# Altium project senior_design.PrjPCB
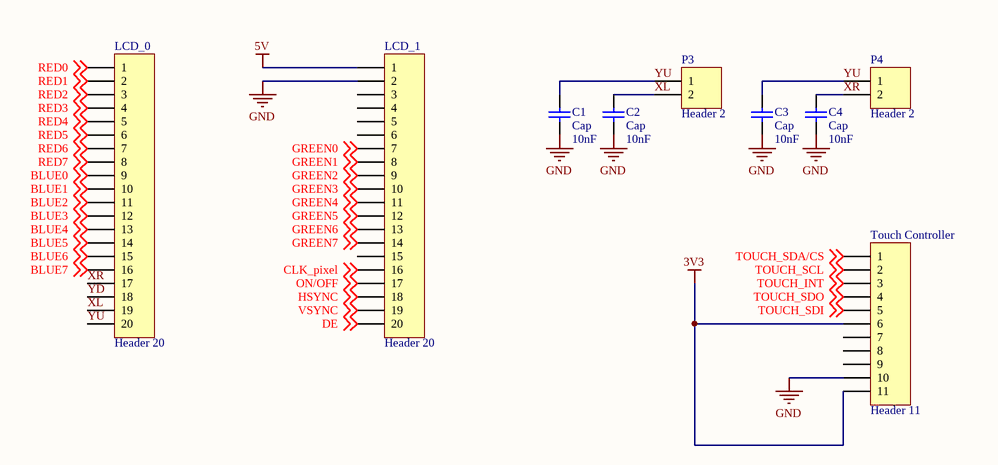
[diagram p0: lcd_breakout.SchDoc]
3 sheets, 19 parts. Net scope: global (net labels, ports and power ports of the same name join across sheets).
Board file: main_pcb_v0.PcbDoc
Sheets:
  lcd_breakout.SchDoc
  fpga_sram.SchDoc
  dac_audio_out.SchDoc

## Sheet lcd_breakout.SchDoc
size A

### Parts
C1  Cap  value 10nF  [6-0805_M]
C2  Cap  value 10nF  [6-0805_M]
C3  Cap  value 10nF  [6-0805_M]
C4  Cap  value 10nF  [6-0805_M]
LCD_0  Header 20  [HDR1X20]
LCD_1  Header 20  [HDR1X20]
P3  Header 2  [HDR1X2]
P4  Header 2  [HDR1X2]
Touch_Controller  Header 11  [HDR1X11]

### Nets
3V3: Touch_Controller.6 Touch_Controller.11
5V: LCD_1.1
GND: C1.1 C2.1 C3.1 C4.1 LCD_1.2 Touch_Controller.10
BLUE0: LCD_0.9 ; off-sheet BLUE0
BLUE1: LCD_0.10 ; off-sheet BLUE1
BLUE2: LCD_0.11 ; off-sheet BLUE2
BLUE3: LCD_0.12 ; off-sheet BLUE3
BLUE4: LCD_0.13 ; off-sheet BLUE4
BLUE5: LCD_0.14 ; off-sheet BLUE5
BLUE6: LCD_0.15 ; off-sheet BLUE6
BLUE7: LCD_0.16 ; off-sheet BLUE7
CLK_pixel: LCD_1.16 ; off-sheet CLK_pixel
DE: LCD_1.20 ; off-sheet DE
GREEN0: LCD_1.7 ; off-sheet GREEN0
GREEN1: LCD_1.8 ; off-sheet GREEN1
GREEN2: LCD_1.9 ; off-sheet GREEN2
GREEN3: LCD_1.10 ; off-sheet GREEN3
GREEN4: LCD_1.11 ; off-sheet GREEN4
GREEN5: LCD_1.12 ; off-sheet GREEN5
GREEN6: LCD_1.13 ; off-sheet GREEN6
GREEN7: LCD_1.14 ; off-sheet GREEN7
HSYNC: LCD_1.18 ; off-sheet HSYNC
ON/OFF: LCD_1.17 ; off-sheet ON/OFF
RED0: LCD_0.1 ; off-sheet RED0
RED1: LCD_0.2 ; off-sheet RED1
RED2: LCD_0.3 ; off-sheet RED2
RED3: LCD_0.4 ; off-sheet RED3
RED4: LCD_0.5 ; off-sheet RED4
RED5: LCD_0.6 ; off-sheet RED5
RED6: LCD_0.7 ; off-sheet RED6
RED7: LCD_0.8 ; off-sheet RED7
TOUCH_INT: Touch_Controller.3 ; off-sheet TOUCH_INT
TOUCH_SCL: Touch_Controller.2 ; off-sheet TOUCH_SCL
TOUCH_SDA/CS: Touch_Controller.1 ; off-sheet TOUCH_SDA/CS
TOUCH_SDI: Touch_Controller.5 ; off-sheet TOUCH_SDI
TOUCH_SDO: Touch_Controller.4 ; off-sheet TOUCH_SDO
VSYNC: LCD_1.19 ; off-sheet VSYNC
XL: C2.2 LCD_0.19 P3.2
XR: C4.2 LCD_0.17 P4.2
YD: LCD_0.18
YU: C1.2 C3.2 LCD_0.20 P3.1 P4.1

Not connected (* = marked no-connect by the designer): LCD_1 3 4 5 6 15; Touch_Controller 7 8 9

### Library data of the parts
C1-C4 = Cap: Capacitor; Published: 8-Jun-2000; LatestRevisionDate: 17-Jul-2002; LatestRevisionNote: Re-released for DXP Platform.; PackageReference: RAD-0.3; Publisher: Altium Limited; PackageDescription: Radial Cap, Thru-Hole; 2 Leads; 0.3 in Pin Spacing
LCD_0 LCD_1 = Header 20: Header, 20-Pin; LatestRevisionDate: 17-Jul-2002; LatestRevisionNote: Re-released for DXP Platform.; Publisher: Altium Limited
P3 P4 = Header 2: Header, 2-Pin; LatestRevisionDate: 17-Jul-2002; LatestRevisionNote: Re-released for DXP Platform.; Publisher: Altium Limited
Touch_Controller = Header 11: Header, 11-Pin; LatestRevisionDate: 17-Jul-2002; LatestRevisionNote: Re-released for DXP Platform.; Publisher: Altium Limited

## Sheet fpga_sram.SchDoc
size A
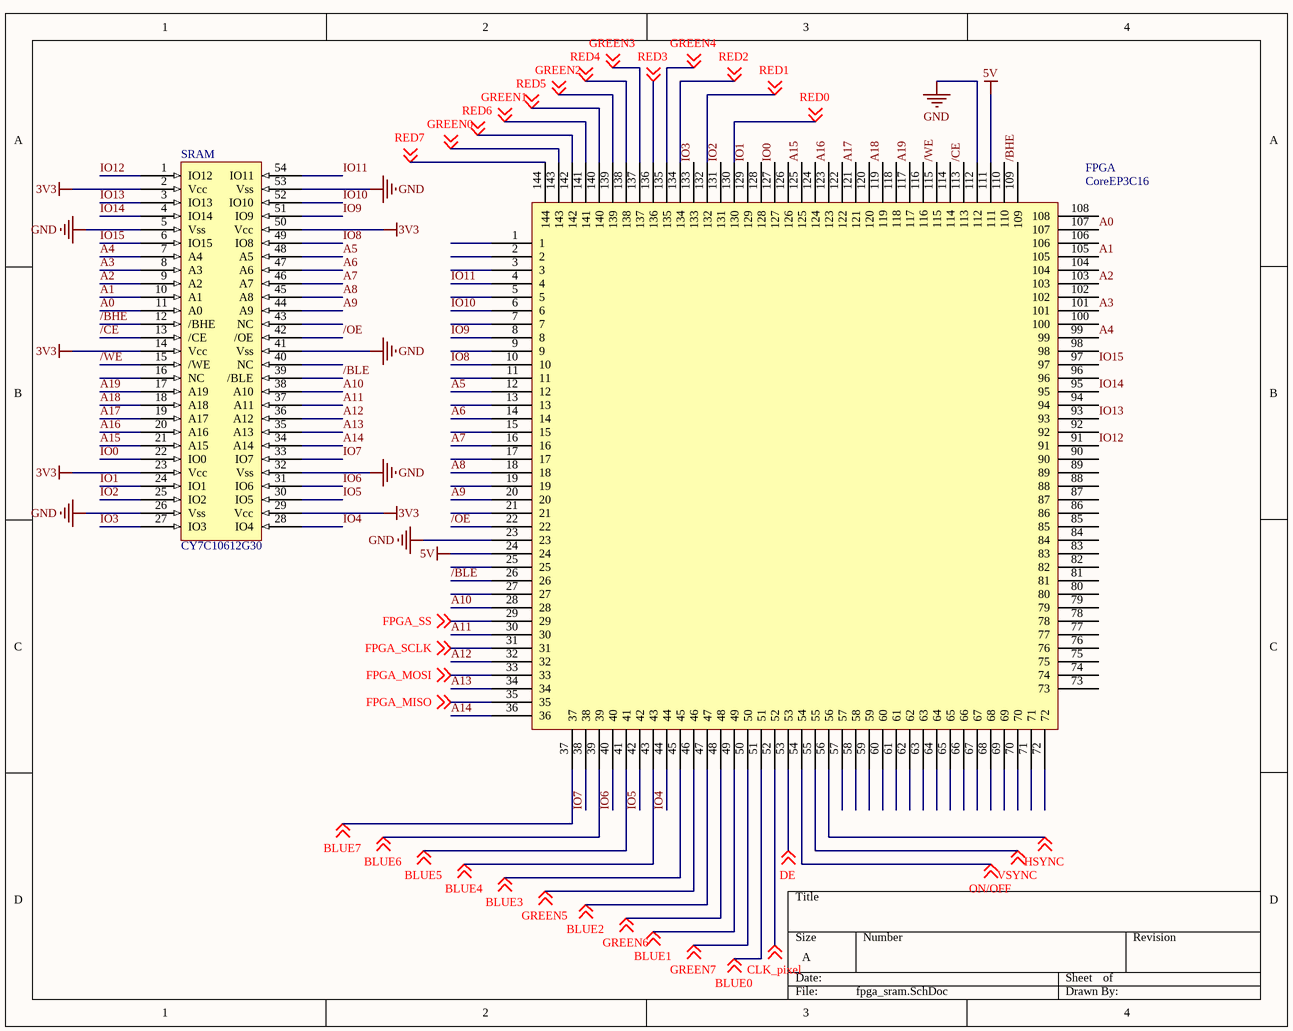
[diagram p1: fpga_sram.SchDoc]

### Parts
FPGA  CoreEP3C16  [CoreEP3C16]
SRAM  CY7C10612G30  [TSOP54]

### Nets
3V3: SRAM.2(Vcc) SRAM.14(Vcc) SRAM.23(Vcc) SRAM.29(Vcc) SRAM.50(Vcc)
5V: FPGA.24 FPGA.111
GND: FPGA.23 FPGA.112 SRAM.5(Vss) SRAM.26(Vss) SRAM.32(Vss) SRAM.41(Vss) SRAM.53(Vss)
/BHE: FPGA.109 SRAM.12(/BHE)
/BLE: FPGA.26 SRAM.39(/BLE)
/CE: FPGA.113 SRAM.13(/CE)
/OE: FPGA.22 SRAM.42(/OE)
/WE: FPGA.115 SRAM.15(/WE)
A0: FPGA.107 SRAM.11(A0)
A1: FPGA.105 SRAM.10(A1)
A2: FPGA.103 SRAM.9(A2)
A3: FPGA.101 SRAM.8(A3)
A4: FPGA.99 SRAM.7(A4)
A5: FPGA.12 SRAM.48(A5)
A6: FPGA.14 SRAM.47(A6)
A7: FPGA.16 SRAM.46(A7)
A8: FPGA.18 SRAM.45(A8)
A9: FPGA.20 SRAM.44(A9)
A10: FPGA.28 SRAM.38(A10)
A11: FPGA.30 SRAM.37(A11)
A12: FPGA.32 SRAM.36(A12)
A13: FPGA.34 SRAM.35(A13)
A14: FPGA.36 SRAM.34(A14)
A15: FPGA.125 SRAM.21(A15)
A16: FPGA.123 SRAM.20(A16)
A17: FPGA.121 SRAM.19(A17)
A18: FPGA.119 SRAM.18(A18)
A19: FPGA.117 SRAM.17(A19)
BLUE0: FPGA.51 ; off-sheet BLUE0
BLUE1: FPGA.49 ; off-sheet BLUE1
BLUE2: FPGA.47 ; off-sheet BLUE2
BLUE3: FPGA.45 ; off-sheet BLUE3
BLUE4: FPGA.43 ; off-sheet BLUE4
BLUE5: FPGA.41 ; off-sheet BLUE5
BLUE6: FPGA.39 ; off-sheet BLUE6
BLUE7: FPGA.37 ; off-sheet BLUE7
CLK_pixel: FPGA.52 ; off-sheet CLK_pixel
DE: FPGA.53 ; off-sheet DE
FPGA_MISO: FPGA.35 ; off-sheet FPGA_MISO
FPGA_MOSI: FPGA.33 ; off-sheet FPGA_MOSI
FPGA_SCLK: FPGA.31 ; off-sheet FPGA_SCLK
FPGA_SS: FPGA.29 ; off-sheet FPGA_SS
GREEN0: FPGA.143 ; off-sheet GREEN0
GREEN1: FPGA.141 ; off-sheet GREEN1
GREEN2: FPGA.139 ; off-sheet GREEN2
GREEN3: FPGA.137 ; off-sheet GREEN3
GREEN4: FPGA.135 ; off-sheet GREEN4
GREEN5: FPGA.46 ; off-sheet GREEN5
GREEN6: FPGA.48 ; off-sheet GREEN6
GREEN7: FPGA.50 ; off-sheet GREEN7
HSYNC: FPGA.56 ; off-sheet HSYNC
IO0: FPGA.127 SRAM.22(IO0)
IO1: FPGA.129 SRAM.24(IO1)
IO2: FPGA.131 SRAM.25(IO2)
IO3: FPGA.133 SRAM.27(IO3)
IO4: FPGA.44 SRAM.28(IO4)
IO5: FPGA.42 SRAM.30(IO5)
IO6: FPGA.40 SRAM.31(IO6)
IO7: FPGA.38 SRAM.33(IO7)
IO8: FPGA.10 SRAM.49(IO8)
IO9: FPGA.8 SRAM.51(IO9)
IO10: FPGA.6 SRAM.52(IO10)
IO11: FPGA.4 SRAM.54(IO11)
IO12: FPGA.91 SRAM.1(IO12)
IO13: FPGA.93 SRAM.3(IO13)
IO14: FPGA.95 SRAM.4(IO14)
IO15: FPGA.97 SRAM.6(IO15)
ON/OFF: FPGA.54 ; off-sheet ON/OFF
RED0: FPGA.130 ; off-sheet RED0
RED1: FPGA.132 ; off-sheet RED1
RED2: FPGA.134 ; off-sheet RED2
RED3: FPGA.136 ; off-sheet RED3
RED4: FPGA.138 ; off-sheet RED4
RED5: FPGA.140 ; off-sheet RED5
RED6: FPGA.142 ; off-sheet RED6
RED7: FPGA.144 ; off-sheet RED7
VSYNC: FPGA.55 ; off-sheet VSYNC

Not connected (* = marked no-connect by the designer): FPGA 1 2 3 5 7 9 11 13 15 17 19 21 25 27 57 58 59 60 61 62 63 64 65 66 67 68 69 70 71 72 73 74 75 76 77 78 79 80 81 82 83 84 85 86 87 88 89 90 92 94 96 98 100 102 104 106 108 110 114 116 118 120 122 124 126 128; SRAM 16(NC) 40(NC) 43(NC)

## Sheet dac_audio_out.SchDoc
size A
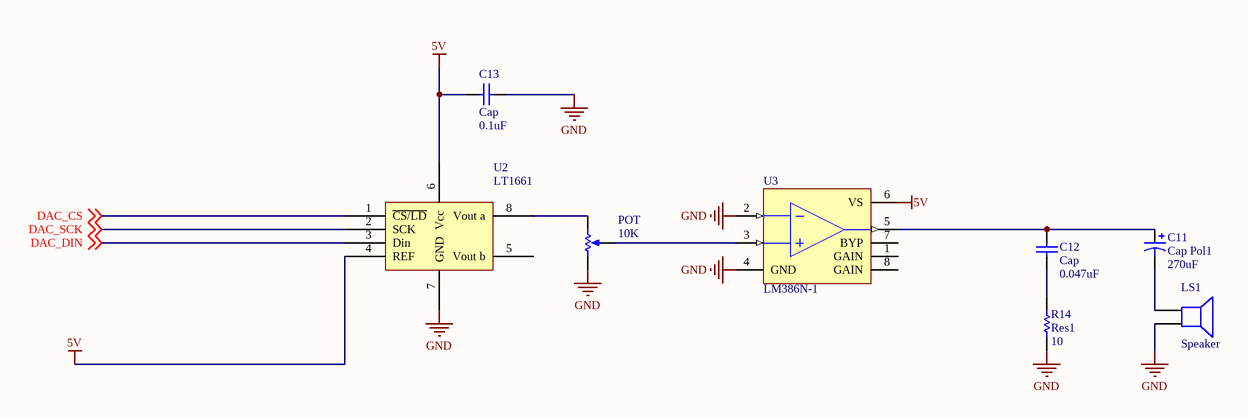
[diagram p2: dac_audio_out.SchDoc]

### Parts
C11  Cap Pol1  value 270uF  [6-0805_M]
C12  Cap  value 0.047uF  [6-0805_M]
C13  Cap  value 0.1uF  [6-0805_M]
LS1  Speaker  [PIN2]
POT  value 10K  [VR5]  (hidden comment: RPot_3)
R14  Res1  value 10  [6-0805_M]
U2  LT1661  [DIP-8]
U3  LM386N-1  [DIP-8]

### Nets
5V: C13.1 U2.4(REF) U2.6(Vcc) U3.6(VS)
GND: C13.2 LS1.2 POT.1(TOP) R14.1 U2.7(GND) U3.2(IN-) U3.4(GND)
DAC_CS: U2.1(~{CS/LD}) ; off-sheet DAC_CS
DAC_DIN: U2.3(Din) ; off-sheet DAC_DIN
DAC_SCK: U2.2(SCK) ; off-sheet DAC_SCK
NetC11_1: C11.1 C12.2 U3.5(OUT)
NetC11_2: C11.2 LS1.1
NetC12_1: C12.1 R14.2
NetPOT_2: POT.2(TAP) U3.3(IN+)
NetPOT_3: POT.3(BOT) U2.8(Vout_a)

Not connected (* = marked no-connect by the designer): U2 5(Vout_b); U3 1(GAIN) 7(BYP) 8(GAIN)

### Library data of the parts
C11 = Cap Pol1: Polarized Capacitor (Radial); Published: 8-Jun-2000; LatestRevisionDate: 17-Jul-2002; LatestRevisionNote: Re-released for DXP Platform.; PackageReference: RB7.6-15; Publisher: Altium Limited; PackageDescription: Polarized Capacitor (Radial); 2 Leads
C12 C13 = Cap: Capacitor; Published: 8-Jun-2000; LatestRevisionDate: 17-Jul-2002; LatestRevisionNote: Re-released for DXP Platform.; PackageReference: RAD-0.3; Publisher: Altium Limited; PackageDescription: Radial Cap, Thru-Hole; 2 Leads; 0.3 in Pin Spacing
LS1 = Speaker: Loudspeaker; Published: 24-Mar-1999; LatestRevisionDate: 17-Jul-2002; LatestRevisionNote: Re-released for DXP Platform.; PackageReference: PIN2; Publisher: Altium Limited
POT = RPot: Potentiometer; Sim Note: Enter the Resistance value and the set point into parameter fields.; Set Position: 0.5; Published: 8-Jun-2000; LatestRevisionDate: 17-Jul-2002; LatestRevisionNote: Re-released for DXP Platform.; Publisher: Altium Limited
R14 = Res1: Resistor; Published: 8-Jun-2000; LatestRevisionDate: 17-Jul-2002; LatestRevisionNote: Re-released for DXP Platform.; PackageReference: AXIAL-0.3; Publisher: Altium Limited; PackageDescription: Axial Device, Thru-Hole; 2 Leads; 0.3 in Pin Spacing
U3 = LM386N-1: Low-Voltage Audio Power Amplifier; Published: 15-Apr-2002; DatasheetDocument: Sep-1997; PackageDocument: Sep-1997; PackageReference: N08E; Publisher: Altium Limited

## Nets that join several sheets
3V3: lcd_breakout (Touch_Controller.6 Touch_Controller.11), fpga_sram (5 pins)
5V: lcd_breakout (LCD_1.1), fpga_sram (FPGA.24 FPGA.111), dac_audio_out (C13.1 U2.4 U2.6 U3.6)
GND: lcd_breakout (6 pins), fpga_sram (7 pins), dac_audio_out (7 pins)
BLUE0: lcd_breakout (LCD_0.9), fpga_sram (FPGA.51)
BLUE1: lcd_breakout (LCD_0.10), fpga_sram (FPGA.49)
BLUE2: lcd_breakout (LCD_0.11), fpga_sram (FPGA.47)
BLUE3: lcd_breakout (LCD_0.12), fpga_sram (FPGA.45)
BLUE4: lcd_breakout (LCD_0.13), fpga_sram (FPGA.43)
BLUE5: lcd_breakout (LCD_0.14), fpga_sram (FPGA.41)
BLUE6: lcd_breakout (LCD_0.15), fpga_sram (FPGA.39)
BLUE7: lcd_breakout (LCD_0.16), fpga_sram (FPGA.37)
CLK_pixel: lcd_breakout (LCD_1.16), fpga_sram (FPGA.52)
DE: lcd_breakout (LCD_1.20), fpga_sram (FPGA.53)
GREEN0: lcd_breakout (LCD_1.7), fpga_sram (FPGA.143)
GREEN1: lcd_breakout (LCD_1.8), fpga_sram (FPGA.141)
GREEN2: lcd_breakout (LCD_1.9), fpga_sram (FPGA.139)
GREEN3: lcd_breakout (LCD_1.10), fpga_sram (FPGA.137)
GREEN4: lcd_breakout (LCD_1.11), fpga_sram (FPGA.135)
GREEN5: lcd_breakout (LCD_1.12), fpga_sram (FPGA.46)
GREEN6: lcd_breakout (LCD_1.13), fpga_sram (FPGA.48)
GREEN7: lcd_breakout (LCD_1.14), fpga_sram (FPGA.50)
HSYNC: lcd_breakout (LCD_1.18), fpga_sram (FPGA.56)
ON/OFF: lcd_breakout (LCD_1.17), fpga_sram (FPGA.54)
RED0: lcd_breakout (LCD_0.1), fpga_sram (FPGA.130)
RED1: lcd_breakout (LCD_0.2), fpga_sram (FPGA.132)
RED2: lcd_breakout (LCD_0.3), fpga_sram (FPGA.134)
RED3: lcd_breakout (LCD_0.4), fpga_sram (FPGA.136)
RED4: lcd_breakout (LCD_0.5), fpga_sram (FPGA.138)
RED5: lcd_breakout (LCD_0.6), fpga_sram (FPGA.140)
RED6: lcd_breakout (LCD_0.7), fpga_sram (FPGA.142)
RED7: lcd_breakout (LCD_0.8), fpga_sram (FPGA.144)
VSYNC: lcd_breakout (LCD_1.19), fpga_sram (FPGA.55)